# Altium schematic sheet Gumstix_Overo.SchDoc
size A4
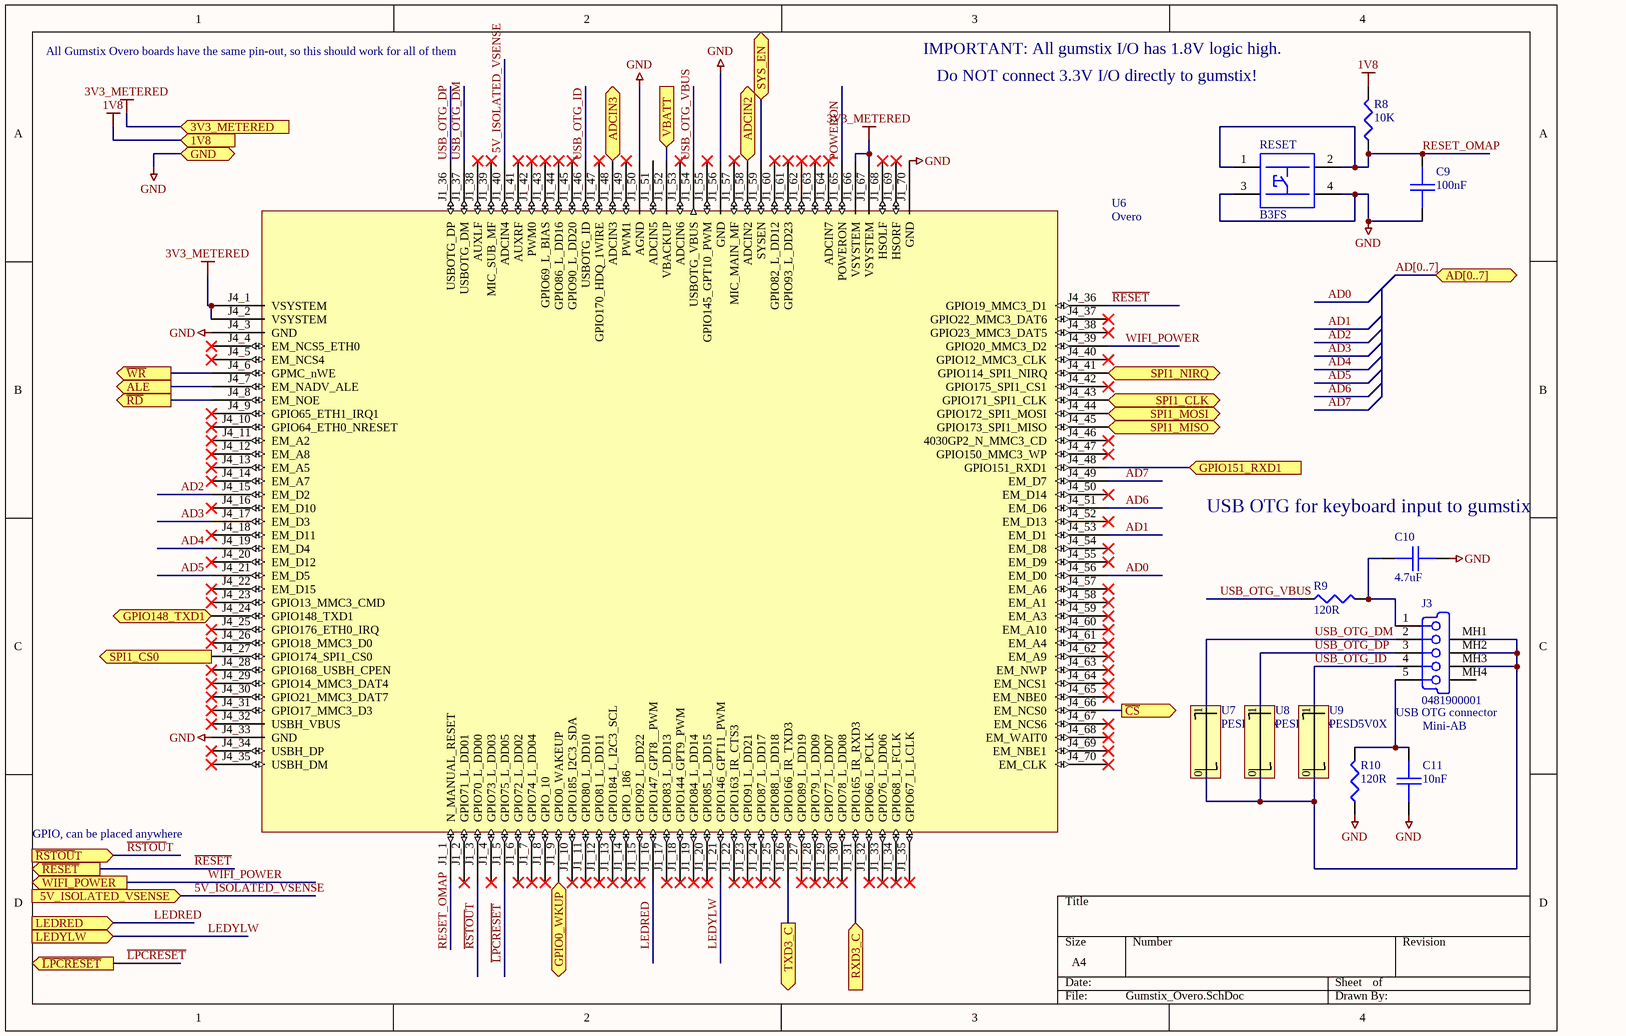
[diagram p0: Gumstix_Overo.SchDoc]

## Parts
C9  100nF  [0603]
C10  4.7uF  [0603]
C11  10nF  [0603]
J3  0481900001  [MINI_USB_Molex]
R8  10K  [0603]
R9  120R  [0603]
R10  120R  [0603]
RESET  B3FS  [B3FS-1052]
U6  Overo  [Overo-bare]
U7  PESD5V0X  [SOD323]
U8  PESD5V0X  [SOD323]
U9  PESD5V0X  [SOD323]

## Ports
1V8 (in), 3V3_METERED (in), 5V_ISOLATED_VSENSE (in), AD[0..7] (bidir), ADCIN2 (in), ADCIN3 (in), ALE (out), GND, GPIO0_WKUP (bidir), GPIO148_TXD1 (out), GPIO151_RXD1 (in), LEDRED (in), LEDYLW (in), RXD3_C (in), SPI1_CLK (out), SPI1_CS0 (out), SPI1_MISO (in), SPI1_MOSI (out), SPI1_NIRQ (in), SYS_EN (bidir), TXD3_C (out), VBATT (in), WIFI_POWER (out), ~{CS} (out), ~{LPCRESET} (out), ~{RD} (out), ~{RESET} (out), ~{RSTOU}T (in), ~{WR} (out)

## Nets
1V8: R8.2 ; port 1V8
3V3_METERED: U6.J1_66(VSYSTEM) U6.J1_67(VSYSTEM) U6.J4_1(VSYSTEM) U6.J4_2(VSYSTEM) ; port 3V3_METERED
GND: C9.2 C10.2 C11.2 R10.1 RESET.3(B2) RESET.4(B1) U6.J1_50(AGND) U6.J1_56(GND) U6.J1_70(GND) U6.J4_3(GND) U6.J4_33(GND) ; port GND
5V_ISOLATED_VSENSE: U6.J1_40(ADCIN4) ; port 5V_ISOLATED_VSENSE
AD0: U6.J4_56(EM_D0)
AD1: U6.J4_53(EM_D1)
AD2: U6.J4_15(EM_D2)
AD3: U6.J4_17(EM_D3)
AD4: U6.J4_19(EM_D4)
AD5: U6.J4_21(EM_D5)
AD6: U6.J4_51(EM_D6)
AD7: U6.J4_49(EM_D7)
ADCIN2: U6.J1_58(ADCIN2) ; port ADCIN2
ADCIN3: U6.J1_48(ADCIN3) ; port ADCIN3
ALE: U6.J4_7(EM_NADV_ALE) ; port ALE
~{CS}: U6.J4_66(EM_NCS0) ; port ~{CS}
GPIO0_WKUP: U6.J1_9(GPIO0_WAKEUP) ; port GPIO0_WKUP
GPIO148_TXD1: U6.J4_24(GPIO148_TXD1) ; port GPIO148_TXD1
GPIO151_RXD1: U6.J4_48(GPIO151_RXD1) ; port GPIO151_RXD1
~{LPCRESET}: U6.J1_5(GPIO75_L_DD05) ; port ~{LPCRESET}
LEDRED: U6.J1_16(GPIO147_GPT8__PWM) ; port LEDRED
LEDYLW: U6.J1_21(GPIO146_GPT11_PWM) ; port LEDYLW
POWERON: U6.J1_65(POWERON)
~{RD}: U6.J4_8(EM_NOE) ; port ~{RD}
~{RESET}: U6.J4_36(GPIO19_MMC3_D1) ; port ~{RESET}
~{RSTOU}T: U6.J1_3(GPIO70_L_DD00) ; port ~{RSTOU}T
RESET_OMAP: C9.1 R8.1 RESET.1(A1) RESET.2(A2) U6.J1_1(N_MANUAL_RESET)
RXD3_C: U6.J1_31(GPIO165_IR_RXD3) ; port RXD3_C
SPI1_CLK: U6.J4_43(GPIO171_SPI1_CLK) ; port SPI1_CLK
SPI1_CS0: U6.J4_27(GPIO174_SPI1_CS0) ; port SPI1_CS0
SPI1_MISO: U6.J4_45(GPIO173_SPI1_MISO) ; port SPI1_MISO
SPI1_MOSI: U6.J4_44(GPIO172_SPI1_MOSI) ; port SPI1_MOSI
SPI1_NIRQ: U6.J4_41(GPIO114_SPI1_NIRQ) ; port SPI1_NIRQ
SYS_EN: U6.J1_59(SYSEN) ; port SYS_EN
TXD3_C: U6.J1_26(GPIO166_IR_TXD3) ; port TXD3_C
USB_OTG_DM: J3.2(D-) U6.J1_37(USBOTG_DM) U7.1
USB_OTG_DP: J3.3(D+) U6.J1_36(USBOTG_DP) U8.1
USB_OTG_ID: J3.4(NC) U6.J1_46(USBOTG_ID) U9.1
USB_OTG_VBUS: R9.1 U6.J1_54(USBOTG_VBUS)
VBATT: U6.J1_52(VBACKUP) ; port VBATT
~{WR}: U6.J4_6(GPMC_nWE) ; port ~{WR}
WIFI_POWER: U6.J4_39(GPIO20_MMC3_D2) ; port WIFI_POWER
NetC10_1: C10.1 J3.1(V_BUS_(5V)) R9.2
NetC11_1: C11.1 J3.5(GND) R10.2
NetJ3_MH1: J3.MH1(Tab) J3.MH2(Tab) J3.MH3(Tab) U7.0 U8.0 U9.0

Not connected (* = marked no-connect by the designer): J3 MH4(Tab); U6 J1_2(GPIO71_L_DD01)* J1_4(GPIO73_L_DD03)* J1_6(GPIO72_L_DD02)* J1_7(GPIO74_L_DD04)* J1_8(GPIO_10)* J1_10(GPIO185_I2C3_SDA)* J1_11(GPIO80_L_DD10)* J1_12(GPIO81_L_DD11)* J1_13(GPIO184_L_I2C3_SCL)* J1_14(GPIO_186)* J1_15(GPIO92_L_DD22)* J1_17(GPIO83_L_DD13)* J1_18(GPIO144_GPT9_PWM)* J1_19(GPIO84_L_DD14)* J1_20(GPIO85_L_DD15)* J1_22(GPIO163_IR_CTS3)* J1_23(GPIO91_L_DD21)* J1_24(GPIO87_L_DD17)* J1_25(GPIO88_L_DD18)* J1_27(GPIO89_L_DD19)* J1_28(GPIO79_L_DD09)* J1_29(GPIO77_L_DD07)* J1_30(GPIO78_L_DD08)* J1_32(GPIO66_L_PCLK)* J1_33(GPIO76_L_DD06)* J1_34(GPIO68_L_FCLK)* J1_35(GPIO67_L_LCLK)* J1_38(AUXLF)* J1_39(MIC_SUB_MF)* J1_41(AUXRF)* J1_42(PWM0)* J1_43(GPIO69_L_BIAS)* J1_44(GPIO86_L_DD16)* J1_45(GPIO90_L_DD20)* J1_47(GPIO170_HDQ_1WIRE)* J1_49(PWM1)* J1_51(ADCIN5) J1_53(ADCIN6)* J1_55(GPIO145_GPT10_PWM)* J1_57(MIC_MAIN_MF)* J1_60(GPIO82_L_DD12)* J1_61(GPIO93_L_DD23)* J1_62* J1_63* J1_64(ADCIN7)* J1_68(HSOLF)* J1_69(HSORF)* J4_4(EM_NCS5_ETH0)* J4_5(EM_NCS4)* J4_9(GPIO65_ETH1_IRQ1)* J4_10(GPIO64_ETH0_NRESET)* J4_11(EM_A2)* J4_12(EM_A8)* J4_13(EM_A5)* J4_14(EM_A7)* J4_16(EM_D10)* J4_18(EM_D11)* J4_20(EM_D12)* J4_22(EM_D15)* J4_23(GPIO13_MMC3_CMD)* J4_25(GPIO176_ETH0_IRQ)* J4_26(GPIO18_MMC3_D0)* J4_28(GPIO168_USBH_CPEN)* J4_29(GPIO14_MMC3_DAT4)* J4_30(GPIO21_MMC3_DAT7)* J4_31(GPIO17_MMC3_D3)* J4_32(USBH_VBUS)* J4_34(USBH_DP)* J4_35(USBH_DM)* J4_37(GPIO22_MMC3_DAT6)* J4_38(GPIO23_MMC3_DAT5)* J4_40(GPIO12_MMC3_CLK)* J4_42(GPIO175_SPI1_CS1)* J4_46(4030GP2_N_MMC3_CD)* J4_47(GPIO150_MMC3_WP)* J4_50(EM_D14)* J4_52(EM_D13)* J4_54(EM_D8)* J4_55(EM_D9)* J4_57(EM_A6)* J4_58(EM_A1)* J4_59(EM_A3)* J4_60(EM_A10)* J4_61(EM_A4)* J4_62(EM_A9)* J4_63(EM_NWP)* J4_64(EM_NCS1)* J4_65(EM_NBE0)* J4_67(EM_NCS6)* J4_68(EM_WAIT0)* J4_69(EM_NBE1)* J4_70(EM_CLK)*

## Buses and harness runs
bus AD[0..7] = port AD[0..7]

## Notes on the sheet
- All Gumstix Overo boards have the same pin-out, so this should work for all of them
- IMPORTANT: All gumstix I/O has 1.8V logic high.
- Do NOT connect 3.3V I/O directly to gumstix!
- (near C10) USB OTG for keyboard input to gumstix
- USB OTG connector
- Mini-AB
- GPIO, can be placed anywhere

## Library data of the parts
C9-C11 = CAP: Capacitor
  C10: Digikey: 587-1441-1-ND; Farnell: 1688134; DigikeyPrice: 0.42; FarnellPrice: 0.585
J3 = 0481900001: USB On-The-Go (OTG) Mini-B Receptacle, Right Angle, SMT, 0.80mm (.031") Pitch, Solder Tabs with Back Cover, Recessed Type; PCB_Layout: Complies with Manufacturer's Recommendation.; Published: 21-Sep-2007; DatasheetVersion: revA, May-2004; PackageVersion: May-2004; PackageReference: 481900001; Publisher: Altium Limited; PackageDescription: USB Mini-B, Sinking Type, SM; 5 Position; Right Angle, Body 11.45 x 11.8 x 3.9 mm (LxWxH); ComponentLink1Description: Manufacturer Link; ComponentLink1URL: http://www.molex.com/; ComponentLink2Description: Datasheet; ComponentLink2URL: http://www.molex.com/cmc_upload/0/000/895/958/SD-48190-001RevA.pdf; Digikey: WM17122CT-ND; DigikeyPrice: 2.03
R8-R10 = RES1: Resistor
  R9: Digikey: P120GCT-ND; DigikeyPrice: 0.03
  R10: DigikeyPrice: 0.03; Digikey: P120GCT-ND
RESET = B3FS: SMD tactile switch; Farnell: 3121197; OMRON: B3FS-1052; Digikey: SW792-ND
U6 = Overo: Gumstix Overo Motherboard
U7-U9 = PESD5V0X: Ultra low capacitance bidirectional ESD protection diodes; Digikey: 568-4673-1-ND; Farnell: 8737606; FarnellPrice: 1.06